# Altium project TC364_MainBoard_V1.0.PrjPcb
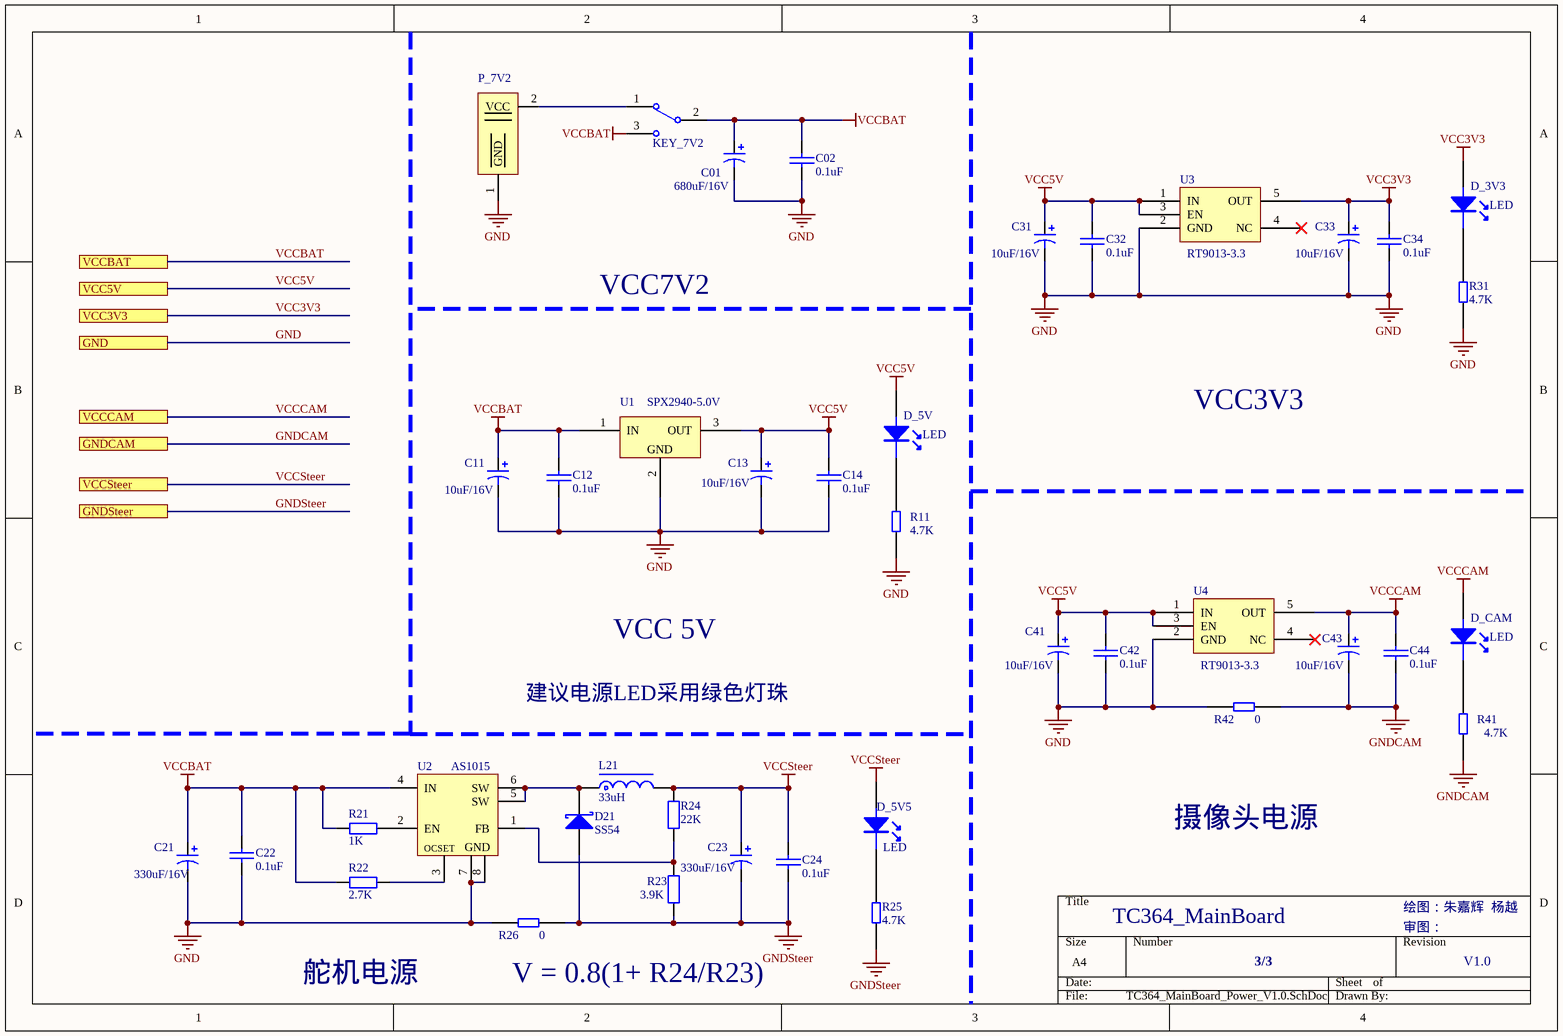
[diagram p0: TC364_MainBoard_Power_V1.0.SchDoc]
2 sheets, 63 parts. Net scope: flat (ports and power ports of the same name join across sheets).
Board files: TC364_MainBoard_PCB.PcbDoc, (Poly)TC364_MainBoard_PCB.PcbDoc
Sheets:
  TC364_MainBoard_Power_V1.0.SchDoc
  TC364_MainBoard_Singal_V1.0.SchDoc

## Sheet TC364_MainBoard_Power_V1.0.SchDoc
size A4

### Parts
C01  680uF/16V  [CAP 3.5*8*11.5 - GD]
C02  0.1uF  [0805_C]
C11  10uF/16V  [CASE-A_3216]
C12  0.1uF  [0805_C]
C13  10uF/16V  [CASE-A_3216]
C14  0.1uF  [0805_C]
C21  330uF/16V  [CAP 2.5*6.3*11.2 - BK]
C22  0.1uF  [0805_C]
C23  330uF/16V  [CAP 2.5*6.3*11.2 - BK]
C24  0.1uF  [0805_C]
C31  10uF/16V  [CASE-A_3216]
C32  0.1uF  [0805_C]
C33  10uF/16V  [CASE-A_3216]
C34  0.1uF  [0805_C]
C41  10uF/16V  [CASE-A_3216]
C42  0.1uF  [0805_C]
C43  10uF/16V  [CASE-A_3216]
C44  0.1uF  [0805_C]
D21  SS54  [SMA]
D_3V3  LED  [0805_LED_S1]
D_5V  LED  [0805_LED_S1]
D_5V5  LED  [0805_LED_S1]
D_CAM  LED  [0805_LED_S1]
KEY_7V2  SS-12F23  [KEY_7V2]  (value not drawn)
L21  33uH  [7*7 L]
P_7V2  T_Type_Adapter  [T_Type_Adapter]  (value not drawn)
R11  4.7K  [0805_R]
R21  1K  [0603_R]
R22  2.7K  [0603_R]
R23  3.9K  [0603_R]
R24  22K  [0603_R]
R25  4.7K  [0805_R]
R26  0  [0805_R]
R31  4.7K  [0805_R]
R41  4.7K  [0805_R]
R42  0  [0805_R]
U1  SPX2940-5.0V  [TO-220(TO-220-3)]
U2  AS1015  [SOP-8_150mil]
U3  RT9013-3.3  [SOT-23-5]
U4  RT9013-3.3  [SOT-23-5]

### Ports
GND, GNDCAM, GNDSteer, VCC3V3, VCC5V, VCCBAT, VCCCAM, VCCSteer

### Nets
GND: C01.2 C02.2 C11.2 C12.2 C13.2 C14.2 C21.2 C22.2 C31.2 C32.2 C33.2 C34.2 C41.2 C42.2 P_7V2.1(GND) R11.2 R26.2 R31.2 R42.2 U1.2(GND) U2.7(GND) U2.8(GND) U3.2(GND) U4.2(GND) ; port GND
GNDCAM: C43.2 C44.2 R41.2 R42.1 ; port GNDCAM
GNDSteer: C23.2 C24.2 D21.1(A) R23.2 R25.2 R26.1 ; port GNDSteer
VCC3V3: C33.1 C34.1 D_3V3.A U3.5(OUT) ; port VCC3V3
VCC5V: C13.1 C14.1 C31.1 C32.1 C41.1 C42.1 D_5V.A U1.3(OUT) U3.1(IN) U3.3(EN) U4.1(IN) U4.3(EN) ; port VCC5V
VCCBAT: C01.1 C02.1 C11.1 C12.1 C21.1 C22.1 KEY_7V2.2 KEY_7V2.3 R21.2 R22.2 U1.1(IN) U2.4(IN) ; port VCCBAT
VCCCAM: C43.1 C44.1 D_CAM.A U4.5(OUT) ; port VCCCAM
VCCSteer: C23.1 C24.1 D_5V5.A L21.2 R24.1 ; port VCCSteer
NetD21_2: D21.2(K) L21.1 U2.5(SW) U2.6(SW)
NetD_3V3_K: D_3V3.K R31.1
NetD_5V5_K: D_5V5.K R25.1
NetD_5V_K: D_5V.K R11.1
NetD_CAM_K: D_CAM.K R41.1
NetKEY_7V2_1: KEY_7V2.1 P_7V2.2(VCC)
NetR21_1: R21.1 U2.2(EN)
NetR22_1: R22.1 U2.3(OCSET)
NetR23_1: R23.1 R24.2 U2.1(FB)

Not connected (* = marked no-connect by the designer): U3 4(NC)*; U4 4(NC)*

### Notes on the sheet
- VCC7V2
- VCC3V3
- VCC 5V
- 建议电源LED采用绿色灯珠
- 摄像头电源
- TC364_MainBoard
- 绘图：朱嘉辉  杨越
- 舵机电源
- V = 0.8(1+ R24/R23)
- 3/3
- 审图：
- V1.0

### Library data of the parts
C01 C11 C13 C21 C23 C31 C33 C41 C43 = Cap Pol1: Polarized Capacitor (Radial); Published: 8-Jun-2000; LatestRevisionDate: 17-Jul-2002; LatestRevisionNote: Re-released for DXP Platform.; PackageReference: RB7.6-15; Publisher: Altium Limited; PackageDescription: Polarized Capacitor (Radial); 2 Leads
C02 C12 C14 C22 C24 C32 C34 C42 C44 = CAP: Capacitor
D21 = SS34: 肖特基二极管; 属性: 40V/3A; BOM名称: 肖特基二极管; 封装库来自淘宝 ID：黄晶宝石: https://shop463601444.taobao.com
D_3V3 D_5V D_5V5 D_CAM = LED: 发光二极管
KEY_7V2 = SSW-1P: 1路波动开关; BOM名称: 波动开关; 版权归属: 封装库来自淘宝 ID：黄晶宝石; 学习资源: www.ooocke.com
L21 = L-CDRH: 功率屏蔽电感; 版权归属: 封装库来自淘宝 ID：黄晶宝石; BOM名称: 功率屏蔽电感; 联系售后: https://shop463601444.taobao.com
R11 R25 R26 R31 R41 R42 = RES
R21-R24 = RES: 贴片电阻; 版权归属: 源创客; BOM名称: 贴片电阻; 学习资源: www.ooocke.com
U1 = LM2940: 5V稳压芯片; 版权归属: 封装库来自淘宝 ID：黄晶宝石; BOM名称: 5V稳压芯片; 联系售后: www.ooocke.com
U2 = AS1015: 可调升压芯片

## Sheet TC364_MainBoard_Singal_V1.0.SchDoc
size A4
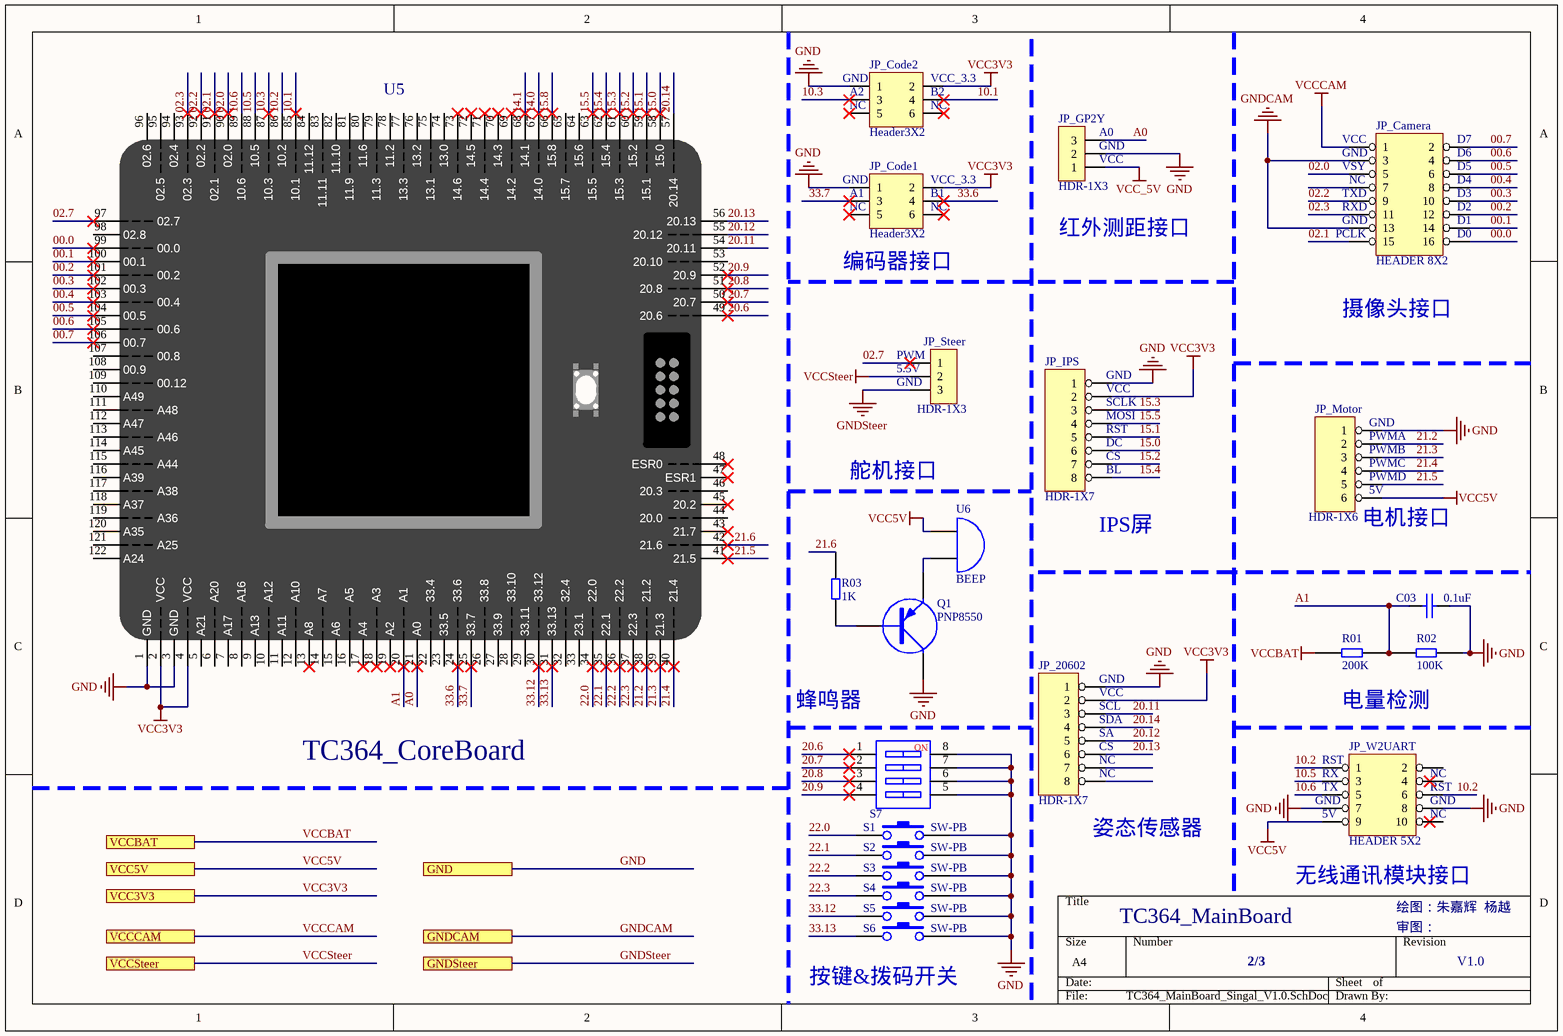
[diagram p1: TC364_MainBoard_Singal_V1.0.SchDoc]

### Parts
C03  0.1uF  [0805_C]
JP_20602  HDR-1X7  [SIP8]
JP_Camera  HEADER 8X2  [IDC16-JLC - duplicate]
JP_Code1  Header3X2  [HDR2.54-LI-2x3P]
JP_Code2  Header3X2  [HDR2.54-LI-2x3P]
JP_GP2Y  HDR-1X3  [HDR2.54-LI-3P]
JP_IPS  HDR-1X7  [SIP8]
JP_Motor  HDR-1X6  [SIP6N]
JP_Steer  HDR-1X3  [HDR2.54-LI-3P]
JP_W2UART  HEADER 5X2  [IDC10-JLC]
Q1  PNP8550  [PNP8550-SO]
R01  200K  [0805_R]
R02  100K  [0805_R]
R03  1K  [0805_R]
S1  SW-PB  [KEY2-6X3]
S2  SW-PB  [KEY2-6X3]
S3  SW-PB  [KEY2-6X3]
S4  SW-PB  [KEY2-6X3]
S5  SW-PB  [KEY2-6X3]
S6  SW-PB  [KEY2-6X3]
S7  SW-4P  [CSW DIP-4P]  (value not drawn)
U5  TC364_CoreBoard  [TC364_CoreBoard]
U6  BEEP  [BUZ]

### Ports
GND, GNDCAM, GNDSteer, VCC3V3, VCC5V, VCCBAT, VCCCAM, VCCSteer

### Nets
GND: C03.2 JP_20602.1 JP_Code1.1 JP_Code2.1 JP_GP2Y.2 JP_IPS.1 JP_Motor.1 JP_W2UART.7 JP_W2UART.8 Q1.3(C) R02.1 S1.2 S2.2 S3.2 S4.2 S5.2 S6.2 S7.5 S7.6 S7.7 S7.8 U5.1(GND) U5.3(GND) ; port GND
GNDCAM: JP_Camera.3 JP_Camera.13 ; port GNDCAM
GNDSteer: JP_Steer.3 ; port GNDSteer
VCC3V3: JP_20602.2 JP_Code1.2 JP_Code2.2 JP_IPS.2 U5.2(VCC) U5.4(VCC) ; port VCC3V3
VCC5V: JP_Motor.6 JP_W2UART.9 U6.1(A) ; port VCC5V
VCC_5V: JP_GP2Y.1
VCCBAT: R01.2 ; port VCCBAT
VCCCAM: JP_Camera.1 ; port VCCCAM
VCCSteer: JP_Steer.2 ; port VCCSteer
00.0: JP_Camera.16 U5.99(00.0)
00.1: JP_Camera.14 U5.100(00.1)
00.2: JP_Camera.12 U5.101(00.2)
00.3: JP_Camera.10 U5.102(00.3)
00.4: JP_Camera.8 U5.103(00.4)
00.5: JP_Camera.6 U5.104(00.5)
00.6: JP_Camera.4 U5.105(00.6)
00.7: JP_Camera.2 U5.106(00.7)
02.0: JP_Camera.5 U5.90(02.0)
02.1: JP_Camera.15 U5.91(02.1)
02.2: JP_Camera.9 U5.92(02.2)
02.3: JP_Camera.11 U5.93(02.3)
02.7: JP_Steer.1 U5.97(02.7)
10.1: JP_Code2.4 U5.85(10.1)
10.2: JP_W2UART.1 JP_W2UART.6 U5.86(10.2)
10.3: JP_Code2.3 U5.87(10.3)
10.5: JP_W2UART.3 U5.88(10.5)
10.6: JP_W2UART.5 U5.89(10.6)
14.0: U5.67(14.0)
14.1: U5.68(14.1)
15.0: JP_IPS.6 U5.58(15.0)
15.1: JP_IPS.5 U5.59(15.1)
15.2: JP_IPS.7 U5.60(15.2)
15.3: JP_IPS.3 U5.61(15.3)
15.4: JP_IPS.8 U5.62(15.4)
15.5: JP_IPS.4 U5.63(15.5)
15.8: U5.66(15.8)
20.6: S7.1 U5.49(20.6)
20.7: S7.2 U5.50(20.7)
20.8: S7.3 U5.51(20.8)
20.9: S7.4 U5.52(20.9)
20.11: JP_20602.3 U5.54(20.11)
20.12: JP_20602.5 U5.55(20.12)
20.13: JP_20602.6 U5.56(20.13)
20.14: JP_20602.4 U5.57(20.14)
21.2: JP_Motor.2 U5.38(21.2)
21.3: JP_Motor.3 U5.39(21.3)
21.4: JP_Motor.4 U5.40(21.4)
21.5: JP_Motor.5 U5.41(21.5)
21.6: R03.1 U5.42(21.6)
22.0: S1.1 U5.34(22.0)
22.1: S2.1 U5.35(22.1)
22.2: S3.1 U5.36(22.2)
22.3: S4.1 U5.37(22.3)
33.6: JP_Code1.4 U5.24(33.6)
33.7: JP_Code1.3 U5.25(33.7)
33.12: S5.1 U5.30(33.12)
33.13: S6.1 U5.31(33.13)
A0: JP_GP2Y.3 U5.21(A0)
A1: C03.1 R01.1 R02.2 U5.20(A1)
NetQ1_1: Q1.1(B) R03.2
NetQ1_2: Q1.2(E) U6.2(B)

Not connected (* = marked no-connect by the designer): JP_20602 7 8; JP_Camera 7; JP_Code1 5* 6*; JP_Code2 5* 6*; JP_W2UART 2 4 10; U5 5(A21) 6(A20) 7(A17) 8(A16) 9(A13) 10(A12) 11(A11) 12(A10) 13(A8)* 14(A7) 15(A6) 16(A5) 17(A4)* 18(A3)* 19(A2)* 22(33.4) 23(33.5) 26(33.8) 27(33.9) 28(33.10) 29(33.11) 32(32.4) 33(23.1) 43(21.7)* 44(20.0) 45(20.2)* 46(20.3) 47(ESR1)* 48(ESR0)* 53(20.10) 64(15.6) 65(15.7) 69(14.2)* 70(14.3)* 71(14.4)* 72(14.5)* 73(14.6)* 74(13.0) 75(13.1) 76(13.2) 77(13.3) 78(11.2) 79(11.3) 80(11.6) 81(11.9) 82(11.10) 83(11.11) 84(11.12) 94(02.4) 95(02.5) 96(02.6) 98(02.8) 107(00.8) 108(00.9) 109(00.12) 110(A49) 111(A48) 112(A47) 113(A46) 114(A45) 115(A44) 116(A39) 117(A38) 118(A37) 119(A36) 120(A35) 121(A25) 122(A24)

### Notes on the sheet
- (near JP_Code2) GND
- (near JP_Code2) A2
- (near JP_Code2) NC
- (near JP_Code2) B2
- (near JP_Code2) VCC_3.3
- (near JP_GP2Y) A0
- (near JP_GP2Y) GND
- (near JP_GP2Y) VCC
- (near JP_Camera) GND
- (near JP_Camera) VSY
- (near JP_Camera) VCC
- (near JP_Camera) D5
- (near JP_Camera) D6
- (near JP_Camera) D7
- (near JP_Code1) GND
- (near JP_Code1) A1
- (near JP_Code1) NC
- (near JP_Code1) B1
- (near JP_Code1) VCC_3.3
- (near JP_GP2Y) 红外测距接口
- (near JP_Camera) PCLK
- (near JP_Camera) TXD
- (near JP_Camera) RXD
- (near JP_Camera) NC
- (near JP_Camera) D0
- (near JP_Camera) D1
- (near JP_Camera) D2
- (near JP_Camera) D3
- (near JP_Camera) D4
- (near JP_Code1) 编码器接口
- (near JP_Steer) PWM
- (near JP_Steer) GND
- (near JP_Steer) 5.5V
- (near JP_IPS) GND
- 摄像头接口
- (near JP_IPS) VCC
- (near JP_IPS) SCLK
- (near JP_IPS) MOSI
- (near JP_IPS) RST
- (near JP_IPS) DC
- (near JP_Motor) GND
- (near JP_Motor) PWMA
- 舵机接口
- (near JP_IPS) CS
- (near JP_IPS) BL
- (near JP_Motor) 5V
- (near JP_Motor) PWMB
- (near JP_Motor) PWMC
- (near JP_Motor) PWMD
- (near JP_IPS) IPS屏
- (near JP_Motor) 电机接口
- 蜂鸣器
- (near JP_20602) VCC
- (near JP_20602) SCL
- (near JP_20602) GND
- 电量检测
- (near JP_20602) SDA
- (near JP_20602) SA
- (near JP_20602) NC
- (near JP_20602) CS
- (near JP_W2UART) TX
- (near JP_W2UART) RX
- (near JP_W2UART) RST
- (near JP_W2UART) NC
- (near JP_20602) 姿态传感器
- (near JP_W2UART) GND
- (near JP_W2UART) 5V
- TC364_MainBoard
- (near JP_W2UART) 无线通讯模块接口
- 绘图：朱嘉辉  杨越
- (near S6) 按键&拨码开关
- 2/3
- 审图：
- V1.0
- (in symbol SW-4P) NO

### Library data of the parts
C03 = CAP: Capacitor
JP_20602 JP_IPS = HEADER 8: 8 Pin Header
JP_Code1 JP_Code2 = Header 3X2: 3*2P接插件; 版权归属: 封装库来自淘宝 ID：黄晶宝石; BOM名称: 3*2P接插件; 学习资源: https://shop463601444.taobao.com
JP_GP2Y JP_Steer = Header 3: 3P接插件; 版权归属: 封装库来自淘宝 ID：黄晶宝石; BOM名称: 3P接插件; 学习资源: https://shop463601444.taobao.com
JP_Motor = HEADER 6
Q1 = PNP: PNP Transistor
R01 R02 R03 = RES
S1-S6 = SW-PB: 按键
S7 = SW-4P: 4路编码开关; 淘宝ID: 封装库来自淘宝 ID：黄晶宝石; BOM名称: 4路编码开关; 学习资源: https://shop463601444.taobao.com
U5 = TC264_CoreBoard: 逐飞科技TC264核心板
U6 = BELL

## Nets that join several sheets
GND: TC364_MainBoard_Power_V1.0 (24 pins), TC364_MainBoard_Singal_V1.0 (23 pins)
GNDCAM: TC364_MainBoard_Power_V1.0 (C43.2 C44.2 R41.2 R42.1), TC364_MainBoard_Singal_V1.0 (JP_Camera.3 JP_Camera.13)
GNDSteer: TC364_MainBoard_Power_V1.0 (6 pins), TC364_MainBoard_Singal_V1.0 (JP_Steer.3)
VCC3V3: TC364_MainBoard_Power_V1.0 (C33.1 C34.1 D_3V3.A U3.5), TC364_MainBoard_Singal_V1.0 (6 pins)
VCC5V: TC364_MainBoard_Power_V1.0 (12 pins), TC364_MainBoard_Singal_V1.0 (JP_Motor.6 JP_W2UART.9 U6.1)
VCCBAT: TC364_MainBoard_Power_V1.0 (12 pins), TC364_MainBoard_Singal_V1.0 (R01.2)
VCCCAM: TC364_MainBoard_Power_V1.0 (C43.1 C44.1 D_CAM.A U4.5), TC364_MainBoard_Singal_V1.0 (JP_Camera.1)
VCCSteer: TC364_MainBoard_Power_V1.0 (5 pins), TC364_MainBoard_Singal_V1.0 (JP_Steer.2)